# EasyEDA Pro project 控制板+驱动.eprj, board PCB
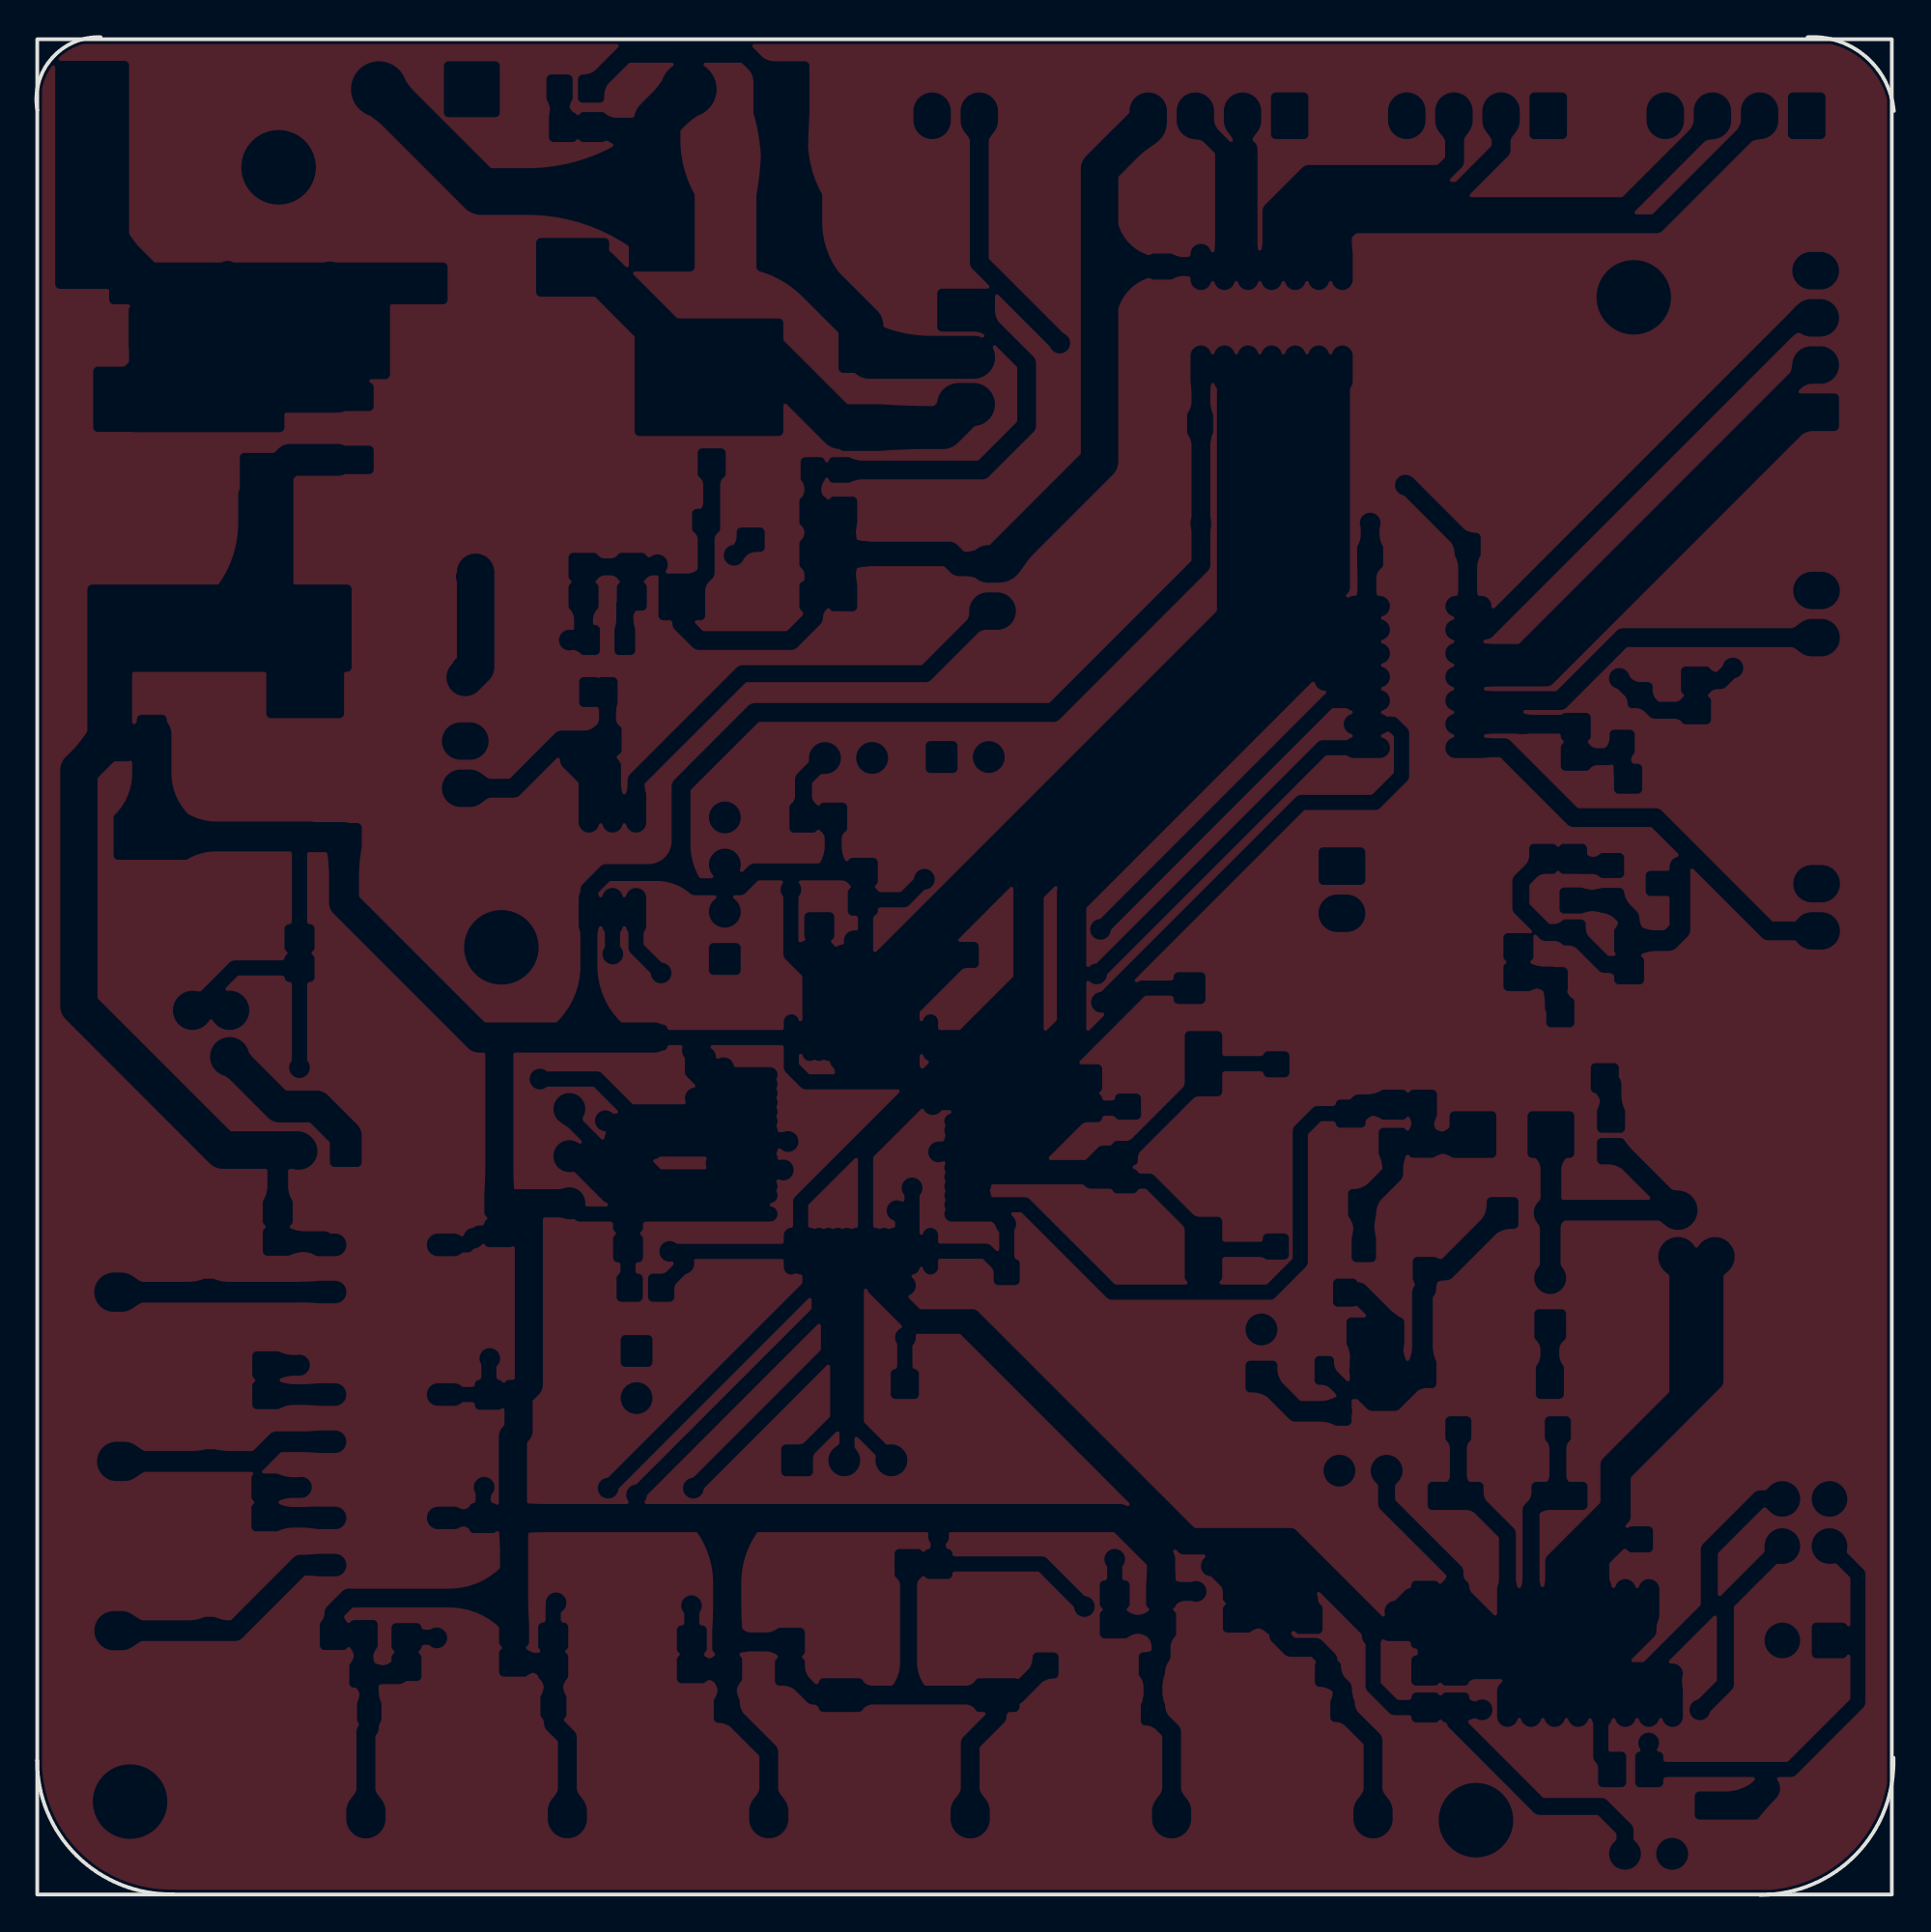
[diagram p2: board, top side]
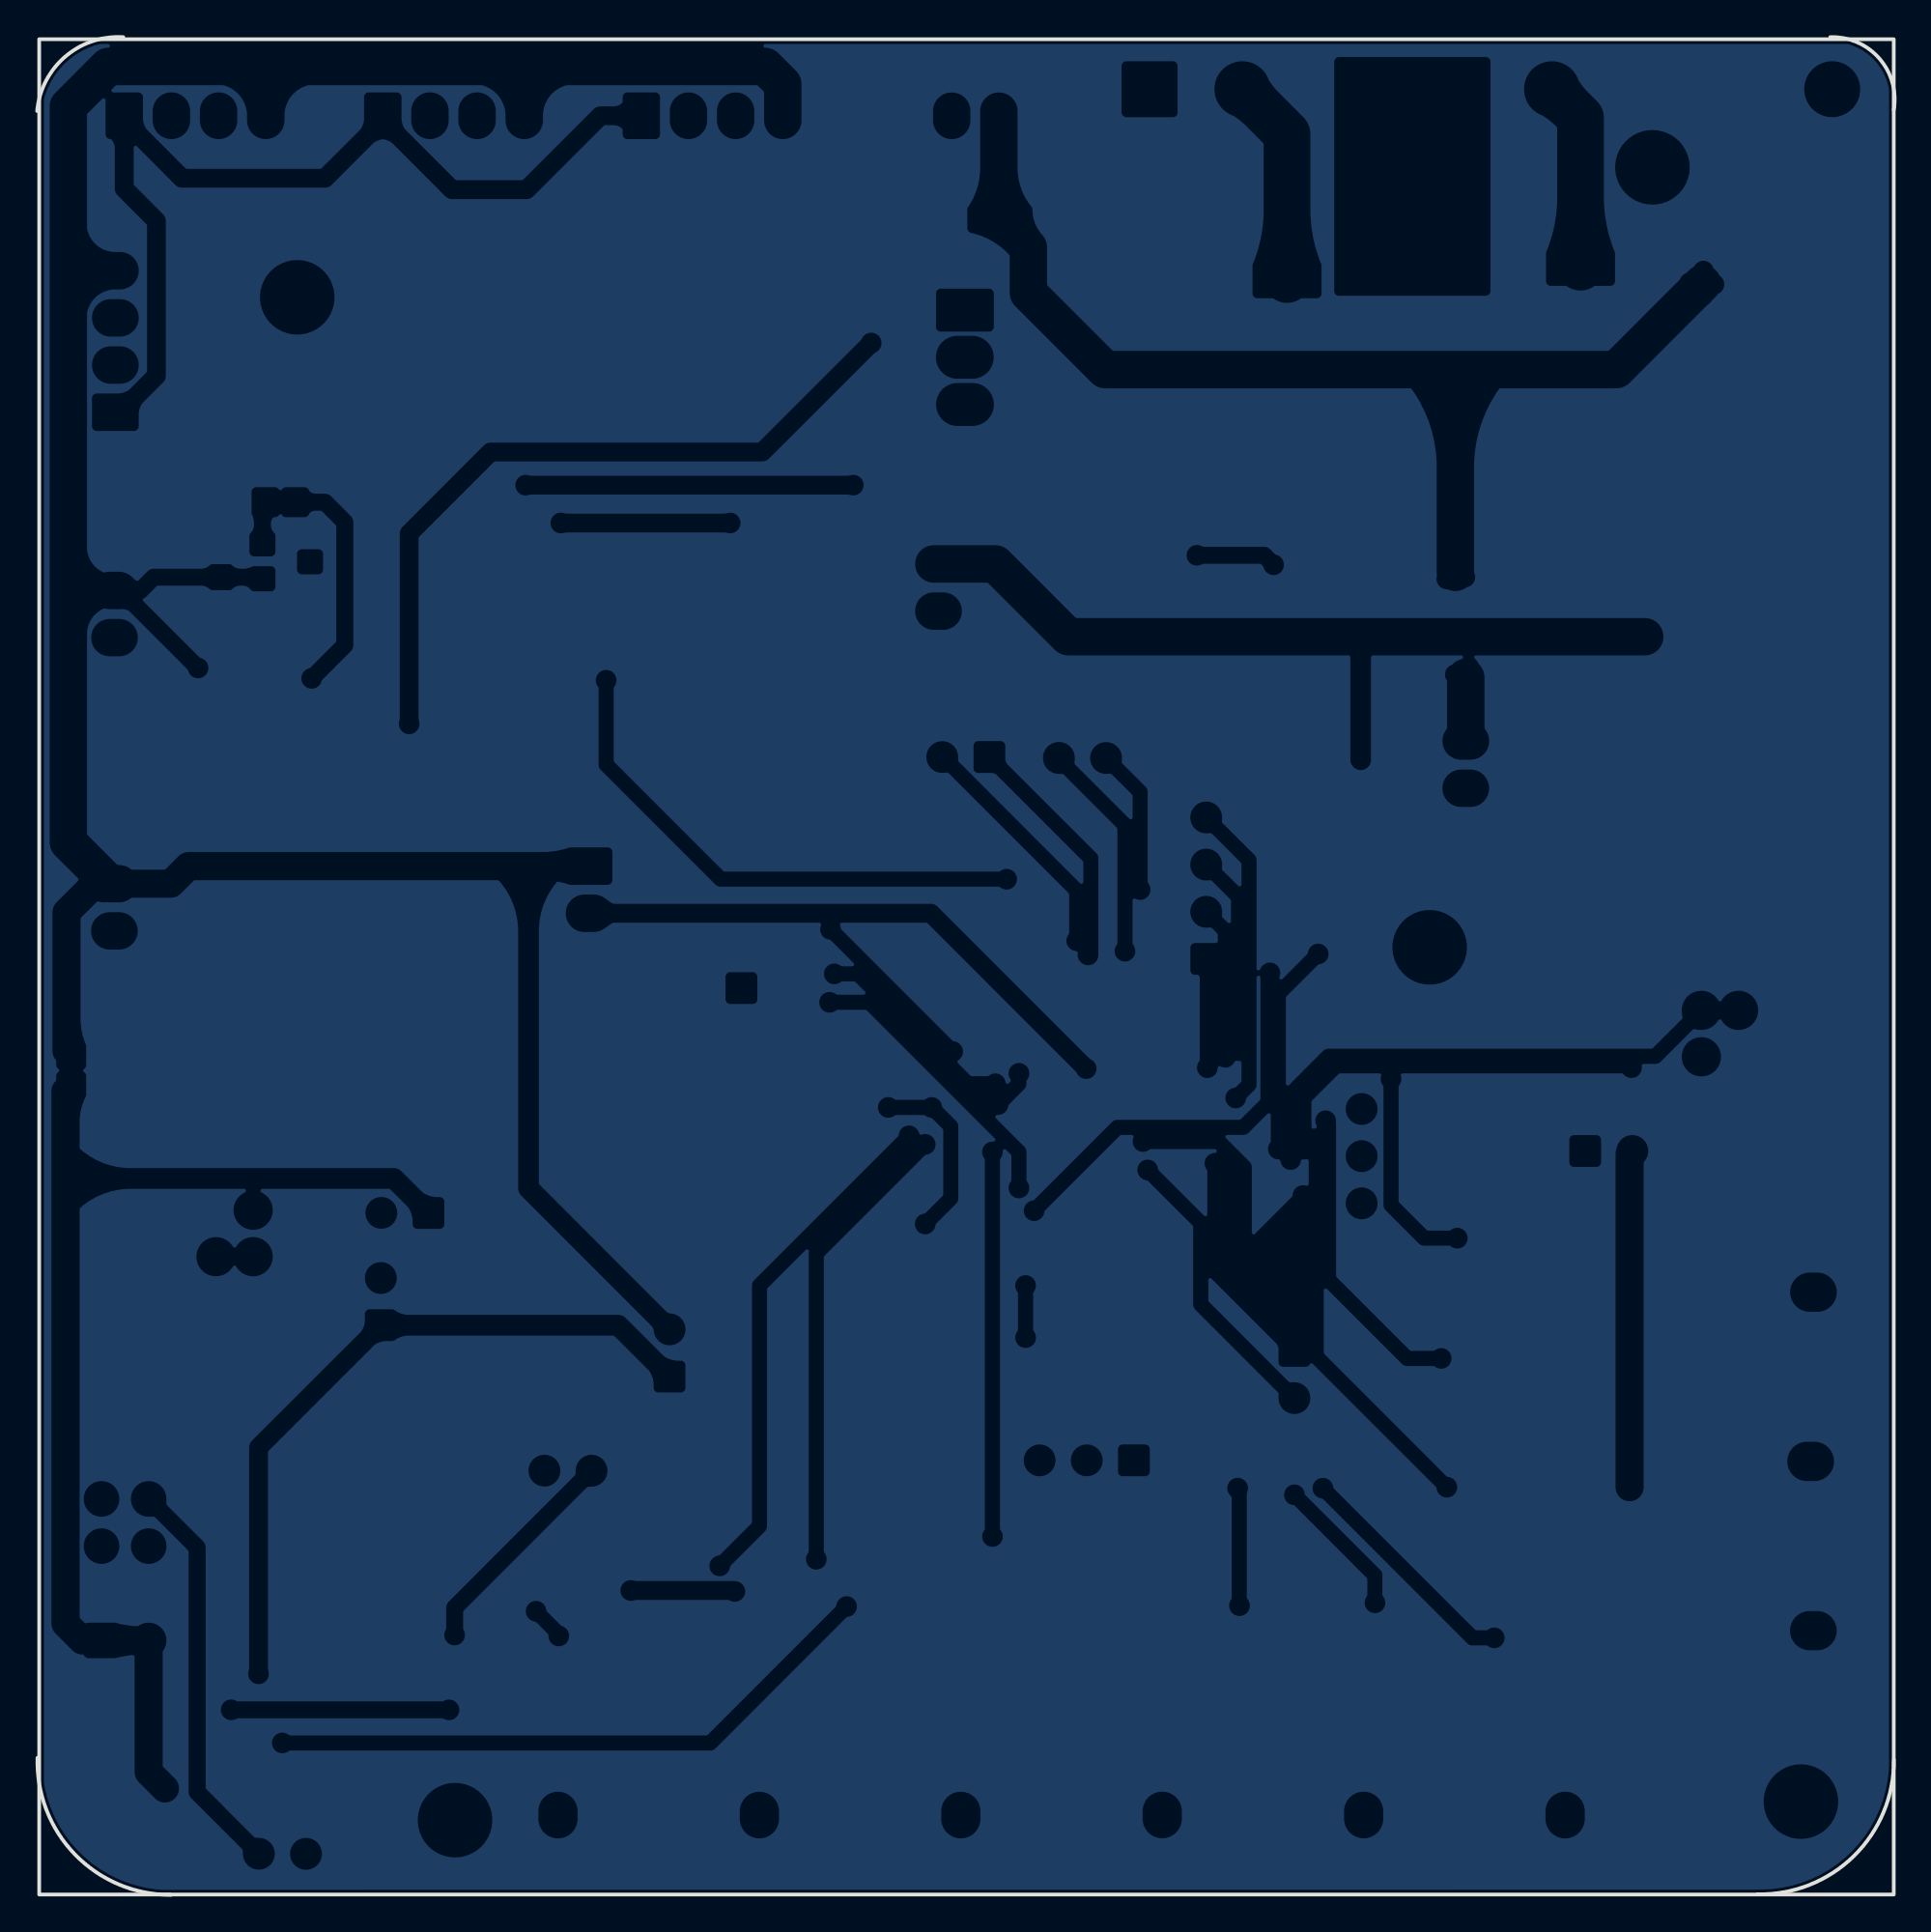
[diagram p3: board, bottom side, seen from below]

Outline 100.02 x 100.03 mm; copper layers: Top Layer, Bottom Layer. Coordinates in mm from the lower left corner of the outline.
Outline path: rectangle 0.01,99.92 99.91,0.02 ; 0.01,96.1 arc(0.78,98.88) 3.42,100.03 ; 7.37,0.03 arc(2.15,2.09) 0,7.27 ; 95.38,100.03 arc(98.5,98.98) 100.02,96.05 ; 100,7.38 arc(97.97,2.16) 92.81,0
Stack: Top Layer 0.035mm / Dielectric1 1.51mm FR4 er 4.5 / Bottom Layer 0.035mm

## Design rules (mm)
template: 用户自定义配置
spacing Default (default): track to track 0.152, other pairs 0 to 0.152
track width Default (default): min 0.254, default 0.254, max 25.4
differential pair differentialPair (default): width min 0.127, default 0.254, max 2.54; gap min 0.152, default 0.152
via Default (default): diameter min 0.25, default 0.61, max 100.025; hole min 0.2, default 0.305, max 59.995

## Placement (name value [footprint] x y rotation side)

## Nets
As in the schematic.

## Copper pours and planes (outline as drawn; the poured copper is in the pictures)
PGND on Top Layer: -1.37,102.27 102.01,102.27 102.01,-1.67 -1.37,-1.67
SGND on Bottom Layer: -1.83,102.48 102.47,102.48 102.47,-1.82 -1.83,-1.82
